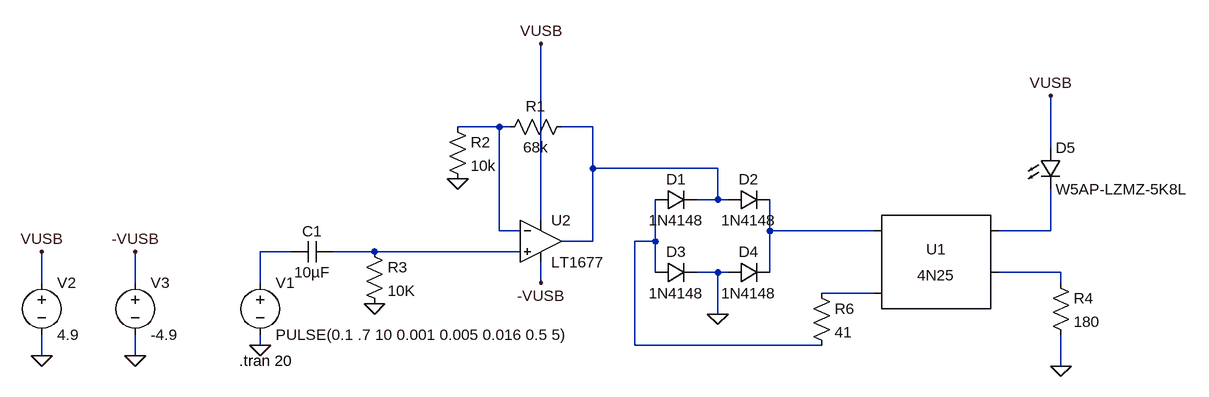
[diagram p0: schematic lightmagic-audio.asc]
lightmagic-audio.asc, the LTspice schematic file:
Version 4
SHEET 1 1720 680
WIRE 192 -64 128 -64
WIRE 208 -64 192 -64
WIRE 336 -64 288 -64
WIRE 1040 -32 1040 -112
WIRE 336 0 336 -64
WIRE 528 0 336 0
WIRE 528 48 528 0
WIRE 528 48 496 48
WIRE 544 48 528 48
WIRE 256 80 256 -192
WIRE 192 96 192 -64
WIRE 224 96 192 96
WIRE 608 96 608 48
WIRE 768 96 608 96
WIRE 1040 96 1040 32
WIRE 1040 96 960 96
WIRE 336 112 336 0
WIRE 336 112 288 112
WIRE 432 112 432 48
WIRE 432 112 400 112
WIRE -128 128 -176 128
WIRE 0 128 -64 128
WIRE 224 128 0 128
WIRE 432 160 432 112
WIRE 528 160 496 160
WIRE 544 160 528 160
WIRE 608 160 608 96
WIRE 1056 160 960 160
WIRE -512 176 -512 128
WIRE -368 176 -368 128
WIRE -176 176 -176 128
WIRE 256 176 256 144
WIRE 1056 176 1056 160
WIRE 768 192 688 192
WIRE 528 224 528 160
WIRE -176 272 -176 256
WIRE 400 272 400 112
WIRE 688 272 400 272
WIRE -512 288 -512 256
WIRE -368 288 -368 256
WIRE 1056 304 1056 256
FLAG -512 128 VUSB
FLAG 256 -192 VUSB
FLAG 256 176 -VUSB
FLAG 128 16 0
FLAG -512 288 0
FLAG -176 272 0
FLAG 0 208 0
FLAG 528 224 0
FLAG -368 128 -VUSB
FLAG -368 288 0
FLAG 1040 -112 VUSB
FLAG 1056 304 0
SYMBOL voltage -176 160 R0
WINDOW 123 24 152 Left 2
WINDOW 39 24 124 Left 2
SYMATTR InstName V1
SYMATTR Value PULSE(0.1 .7 10 0.001 0.005 0.016 0.5 5)
SYMBOL voltage -512 160 R0
WINDOW 123 0 0 Left 2
WINDOW 39 0 0 Left 2
SYMATTR InstName V2
SYMATTR Value 4.9
SYMBOL res 304 -80 R90
WINDOW 0 0 56 VBottom 2
WINDOW 3 32 56 VTop 2
SYMATTR InstName R1
SYMATTR Value 68k
SYMATTR SpiceLine tol=5% pwr=.125
SYMBOL res 112 -80 R0
SYMATTR InstName R2
SYMATTR Value 10k
SYMATTR SpiceLine tol=5 pwr=.125
SYMBOL res -16 112 R0
SYMATTR InstName R3
SYMATTR Value 10K
SYMBOL cap -64 112 R90
WINDOW 0 0 32 VBottom 2
WINDOW 3 32 32 VTop 2
SYMATTR InstName C1
SYMATTR Value 10µF
SYMBOL diode 432 64 R270
WINDOW 0 32 32 VTop 2
WINDOW 3 0 32 VBottom 2
SYMATTR InstName D1
SYMATTR Value 1N4148
SYMBOL diode 544 64 R270
WINDOW 0 32 32 VTop 2
WINDOW 3 0 32 VBottom 2
SYMATTR InstName D2
SYMATTR Value 1N4148
SYMBOL diode 432 176 R270
WINDOW 0 32 32 VTop 2
WINDOW 3 0 32 VBottom 2
SYMATTR InstName D3
SYMATTR Value 1N4148
SYMBOL diode 544 176 R270
WINDOW 0 32 32 VTop 2
WINDOW 3 0 32 VBottom 2
SYMATTR InstName D4
SYMATTR Value 1N4148
SYMBOL Opamps\\LT1677 256 48 R0
SYMATTR InstName U2
SYMBOL res 672 176 R0
SYMATTR InstName R6
SYMATTR Value 41
SYMATTR SpiceLine tol=1 pwr=0.1
SYMBOL Optos\\4N25 864 160 R0
SYMATTR InstName U1
SYMBOL voltage -368 160 R0
WINDOW 123 0 0 Left 2
WINDOW 39 0 0 Left 2
SYMATTR InstName V3
SYMATTR Value -4.9
SYMBOL LED 1024 -32 R0
SYMATTR InstName D5
SYMATTR Value W5AP-LZMZ-5K8L
SYMBOL res 1040 160 R0
SYMATTR InstName R4
SYMATTR Value 180
TEXT -208 296 Left 2 !.tran 20

The netlist it stands for:
* lightmagic-audio.asc
V1 N006 0 PULSE(0.1 .7 10 0.001 0.005 0.016 0.5 5)
V2 VUSB 0 4.9
R1 N002 N001 68k tol=5% pwr=.125
R2 N001 0 10k tol=5 pwr=.125
R3 N007 0 10K
C1 N007 N006 10µF
D1 N005 N002 1N4148
D2 N002 N003 1N4148
D3 N005 0 1N4148
D4 0 N003 1N4148
XU2 N007 N001 VUSB -VUSB N002 LT1677  ; pins In+ In- V+ V- OUT
R6 N009 N005 41 tol=1 pwr=0.1
XU1 N003 N009 N004 N008 NC_01 4N25
V3 -VUSB 0 -4.9
D5 VUSB N004 W5AP-LZMZ-5K8L
R4 N008 0 180
.model D D
.lib standard.dio
.tran 20
.lib LTC.lib
.lib 4N25.sub
.backanno
.end